# EAGLE schematic ProgSwitch (EAGLE 7.4.0)
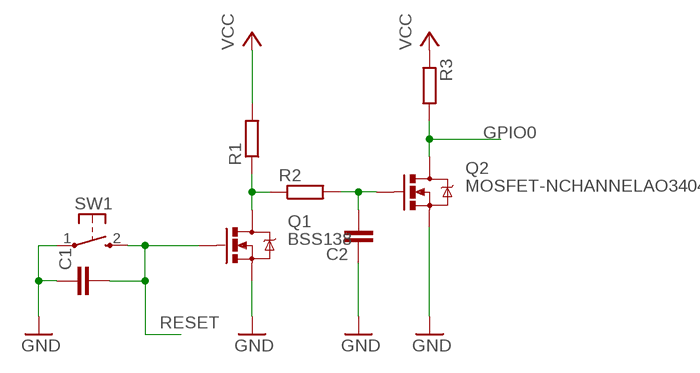
[diagram p0: schematic, sheet 1]

## Parts
C1  C-EU025-024X044  [C025-024X044]
C2  C-EU025-024X044  [C025-024X044]
Q1  BSS138  MOSFET-NCHANNELAO3404A  [SOT23-3]
Q2  MOSFET-NCHANNELAO3404A  [SOT23-3]
R1  R-EU_0204/5  [0204/5]
R2  R-EU_0204/5  [0204/5]
R3  R-EU_0204/5  [0204/5]
SW1  KSS-2EG4430  [KSS-2EG4430]

## Nets
GND: C1.1 C2.1 Q1.2(S) Q2.2(S) SW1.1(P)
GPIO0: Q2.3(D) R3.2
N$3: Q1.3(D) R1.1 R2.1
N$4: C2.2 Q2.1(G) R2.2
RESET: C1.2 Q1.1(G) SW1.2(S)
VCC: R1.2 R3.1

## Library data of the parts
C1 C2 = rcl:C-EU: CAPACITOR, European symbol
Q1 Q2 = SparkFun-DiscreteSemi:MOSFET-NCHANNEL: Common NMOSFET Parts MFG P/N Store ID Prod ID FDD8780 TRANS-09984 SI7820DN TRANS-11055 FDS6630A IC-08089 2N7002PW TRANS-11151 FQP30N06L COM-10213 TRANS-10060 BSS123LT1G TRANS-08345 BSS138 TRANS-00830 BS170 2N7000; PROD_ID: TRAN-12988
R1-R3 = rcl:R-EU_: RESISTOR, European symbol
SW1 = buttons:KSS-2EG4430: Size: 3x6mm Height: 5mm from PCB Rating: DC12v 50mA Travel: 0.25±0.10mm Operating Force: 180±50gf Return Force: 60gf min Contact resistance: 100m? max Insulation resistance: 100M? min Operating life?50,000 cycles